# EasyEDA Pro project 硬件电路设计.epro

# Schematic Schematic1
Create Date: 2024-06-06; Page Name: P1; Project Name: 四轴飞行器; Schematic Name: Schematic1; Update Date: 2024-06-08; Company: 嘉立创EDA; Page Size: A4; Version: V1.0
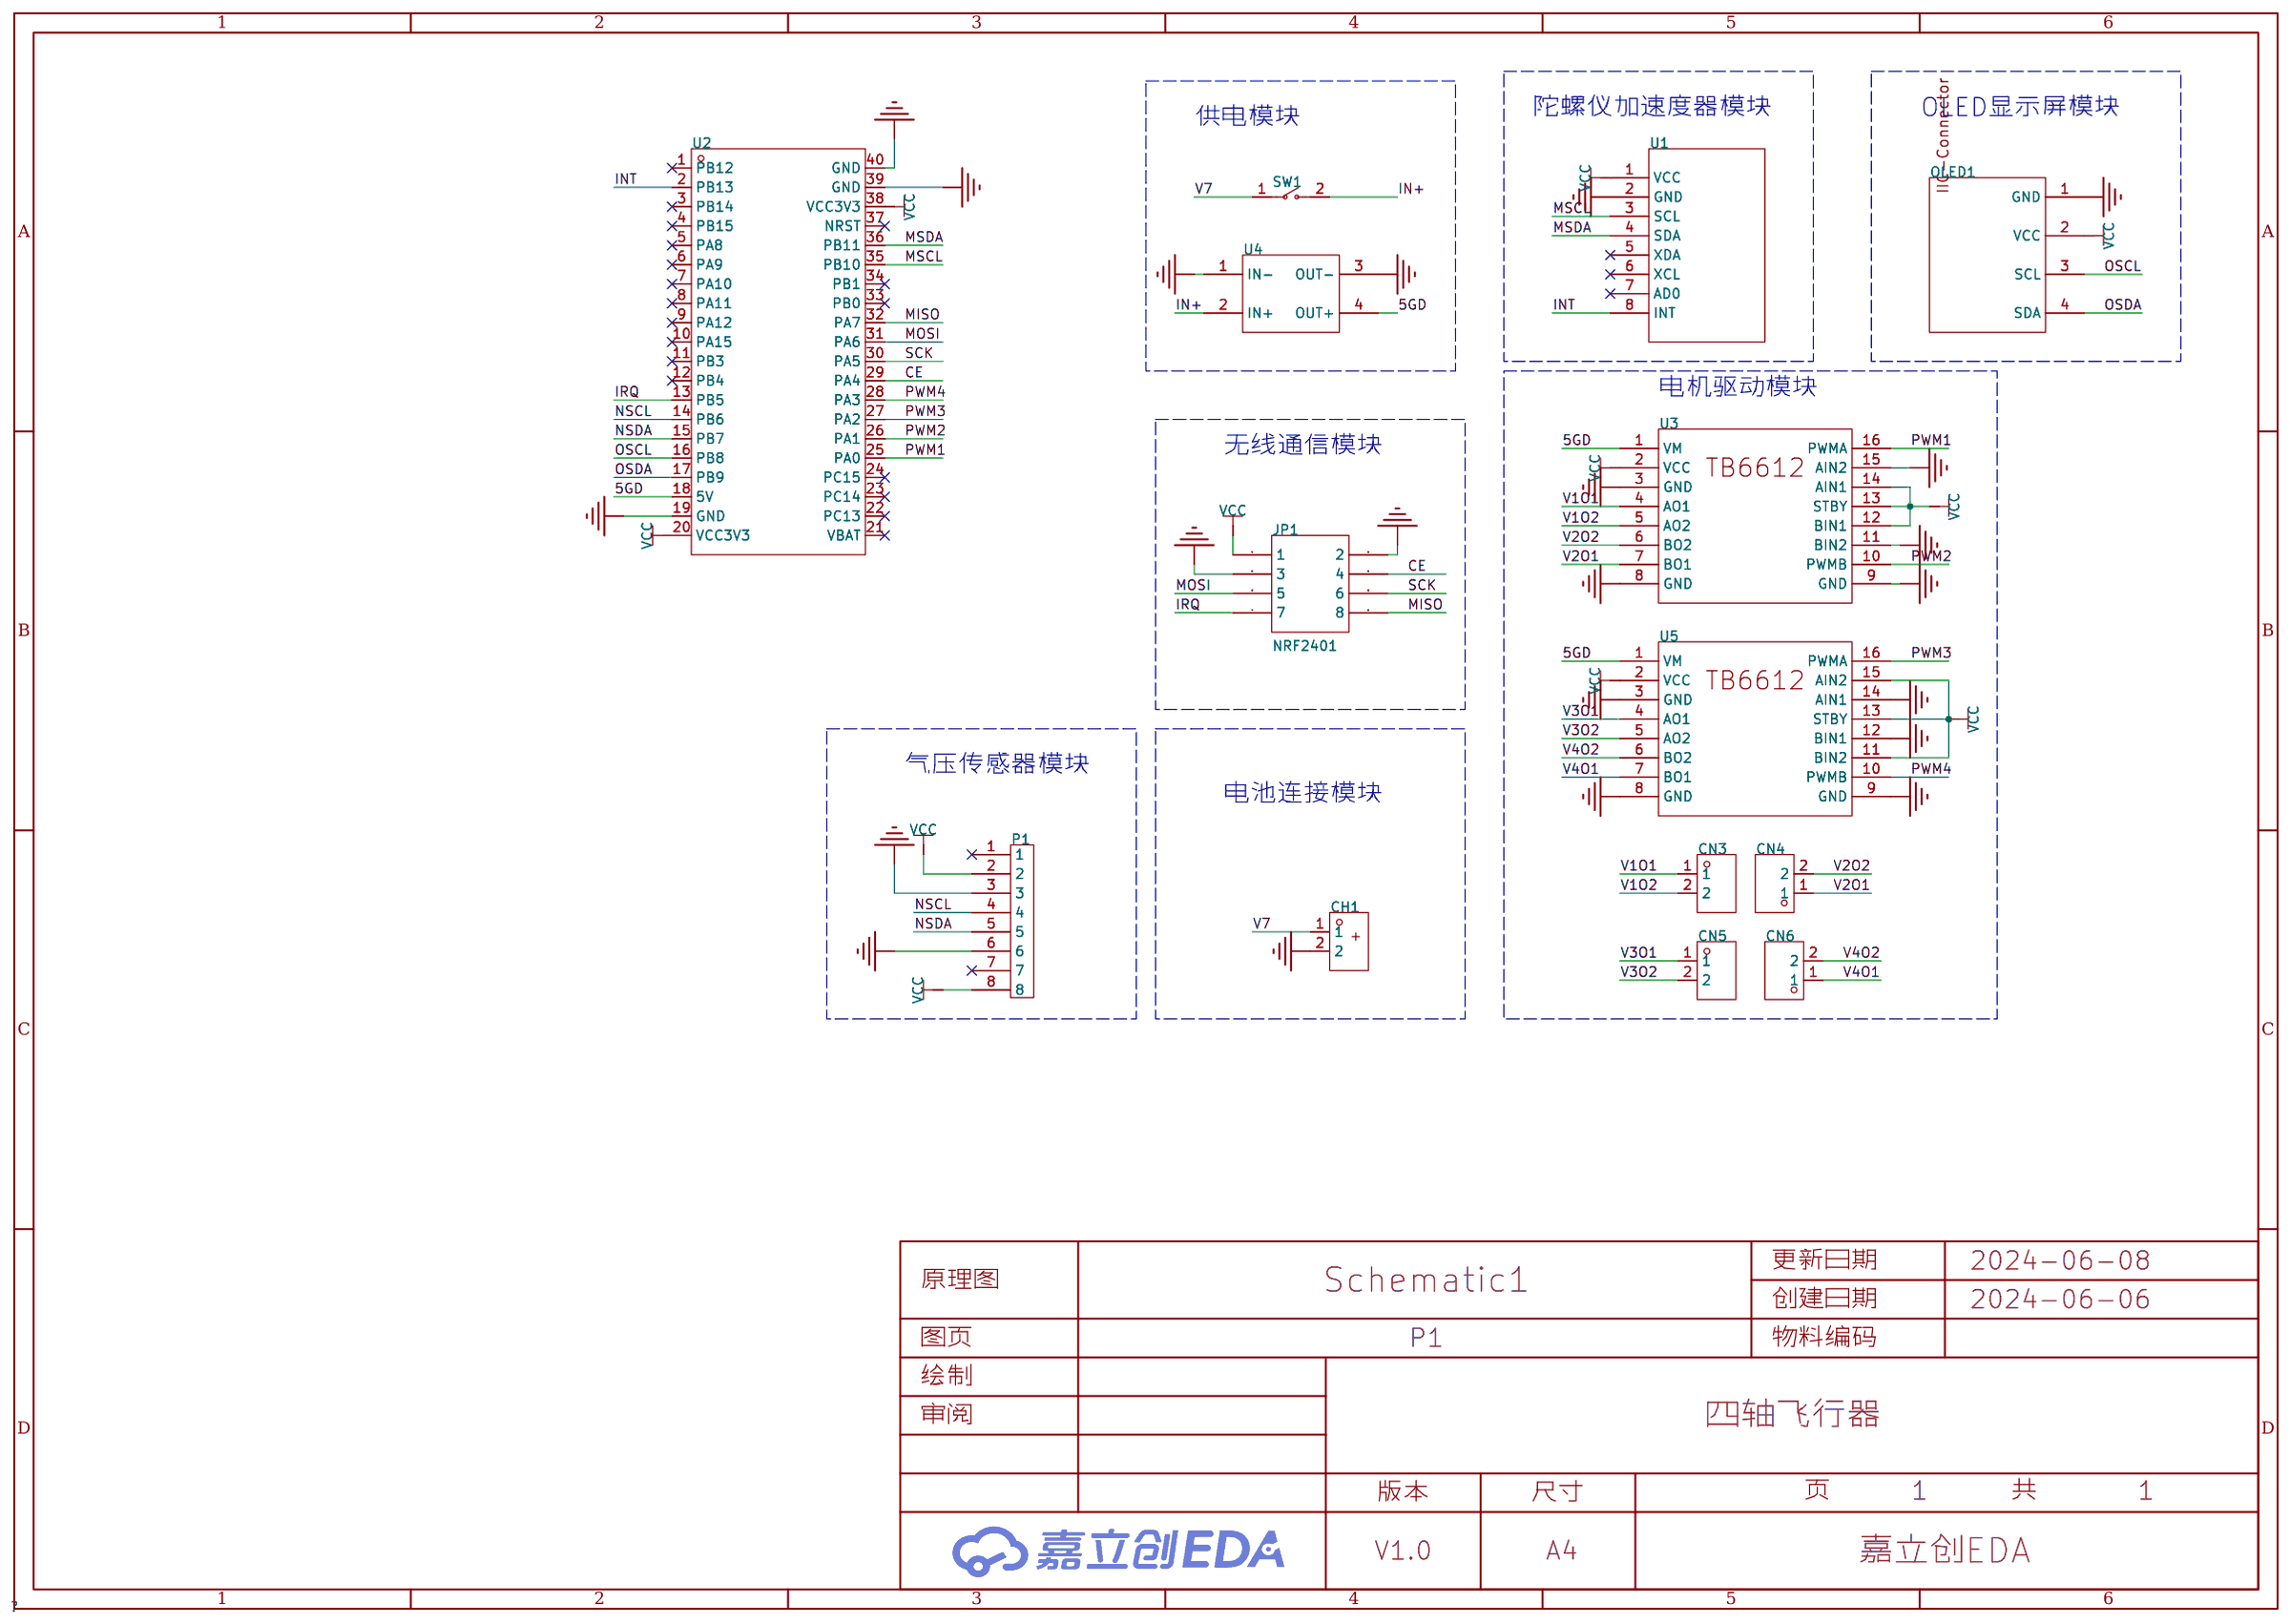
[diagram p0: schematic sheet]

## Parts
CH1  -  [航模电池线通孔]
CN3  ZX-XH2.54-2PZZ  [CONN-TH_2P-P2.50_HX25003-2A]
CN4  ZX-XH2.54-2PZZ  [CONN-TH_2P-P2.50_HX25003-2A]
CN5  ZX-XH2.54-2PZZ  [CONN-TH_2P-P2.50_HX25003-2A]
CN6  ZX-XH2.54-2PZZ  [CONN-TH_2P-P2.50_HX25003-2A]
JP1  NRF2401  [IDE2X4]
OLED1  0.96OLED_4P_MODULE_JX  [0.96OLED_4P]
P1  -  [排针1*8]
SW1  KCD11-2P-R  [SW-TH_2P-L15.0-W10.5-P5.00_KCD11-2P-R]
U1  -  [Module-MPU6050]
U2  STM32F103C8T6-Card  [CONN-TH_L53.3-W22.9_STM32F103C8T6-CARD]
U3  -  [TB6612电机驱动模块]
U4  -  [MP1548EN可调电源模块]
U5  -  [TB6612电机驱动模块]

## Library data of the parts
CH1 = 航模电池接线通孔
CN3-CN6 = ZX-XH2.54-2PZZ: 插针结构:1x2P;间距:2.54mm;安装方式:直插;参考系列:XH;总PIN数:2P;排数:1;每排PIN数:2;行距:-;额定电流:3A;触头材质:黄铜;触头镀层:锡;工作温度范围:-25℃~+85℃;; Supplier Part: C7429632; Manufacturer: Megastar(兆星); Supplier Footprint: 插件,P=2.54mm; JLCPCB Part Class: 扩展库; Datasheet: https://atta.szlcsc.com/upload/public/pdf/source/20230619/19BA6947230AA44A04D3EDD65E618FD0.pdf; Supplier: LCSC; Pins Structure: 1x2P; Pitch: 2.54mm; Mounting Style: 直插; Reference Series: XH; Number of Pins: 2P; Number of Rows: 1; Number of PINs Per Row: 2; Current Rating (Max): 3A; Contact Material: 黄铜; Contact Plating: 锡; Operating Temperature Range: -25℃~+85℃
JP1 = NRF2401
OLED1 = 0.96OLED_4P_MODULE_JX: Supplier Part: C9900004566; Supplier Footprint: 插件; JLCPCB Part Class: 扩展库; Supplier: LCSC
P1 = 排针1*8
SW1 = KCD11-2P-R: 带灯:无;引脚样式:焊片;额定电流:3A;额定电压(AC):250V;额定电压(DC):-;电路结构:单刀单掷;机械寿命:1万次;; LCSC Part Name: 10.5*15mm 两脚两档跷板开关 红钮; Supplier Part: C5884414; Manufacturer: SHOU HAN(首韩); Supplier Footprint: 插件; JLCPCB Part Class: 扩展库; Datasheet: https://atta.szlcsc.com/upload/public/pdf/source/20230506/CD06DFDE35C8048D34175BFF4AF6A2C2.pdf; Supplier: LCSC; Switch Length: 15mm; Switch Width: 10.5mm; Switch Height: 17.2mm; Actuator Type: 凹面弯曲; With Lamp: 无; Pin Style: 焊片; Actuator Color: 红色; Contact Current: 3A; Voltage Rating (AC): 250V; Circuit: 单刀单掷; Mechanical Life: 1万次; Operating Temperature: 0℃~+125℃; Actuator Identifier: - O
U1 = MPU6050模块
U2 = STM32F103C8T6-Card: Supplier Part: C9900077949; Supplier Footprint: 插件; Supplier: LCSC
U3 U5 = TB6612电机驱动模块
U4 = MP1584EN可调电源降压模块: 输入4.5-28V；输出0.8-20V，Max3A；尺寸22*17*4mm; Manufacturer: 淘宝zave旗舰店

## Nets
GND: CH1.2 JP1.2 JP1.3 OLED1.1(GND) P1.3 P1.6 U1.2(GND) U2.19(GND) U2.39(GND) U2.40(GND) U3.3(GND) U3.8(GND) U3.9(GND) U3.11(BIN2) U3.15(AIN2) U4.1(IN-) U4.3(OUT-) U5.3(GND) U5.8(GND) U5.9(GND) U5.12(BIN1) U5.14(AIN1)
V1O1: CN3.1 U3.4(AO1)
V1O2: CN3.2 U3.5(AO2)
V2O1: CN4.1 U3.7(BO1)
V2O2: CN4.2 U3.6(BO2)
V3O1: CN5.1 U5.4(AO1)
V3O2: CN5.2 U5.5(AO2)
V4O1: CN6.1 U5.7(BO1)
V4O2: CN6.2 U5.6(BO2)
V7: CH1.1 SW1.1
VCC: JP1.1 OLED1.2(VCC) P1.2 P1.8 U1.1(VCC) U2.20(VCC3V3) U2.38(VCC3V3) U3.2(VCC) U3.12(BIN1) U3.13(STBY) U3.14(AIN1) U5.2(VCC) U5.11(BIN2) U5.13(STBY) U5.15(AIN2)
5GD: U2.18(5V) U3.1(VM) U4.4(OUT+) U5.1(VM)
CE: JP1.4 U2.29(PA4)
IN+: SW1.2 U4.2(IN+)
INT: U1.8(INT) U2.2(PB13)
IRQ: JP1.7 U2.13(PB5)
MISO: JP1.8 U2.32(PA7)
MOSI: JP1.5 U2.31(PA6)
MSCL: U1.3(SCL) U2.35(PB10)
MSDA: U1.4(SDA) U2.36(PB11)
NSCL: P1.4 U2.14(PB6)
NSDA: P1.5 U2.15(PB7)
OSCL: OLED1.3(SCL) U2.16(PB8)
OSDA: OLED1.4(SDA) U2.17(PB9)
PWM1: U2.25(PA0) U3.16(PWMA)
PWM2: U2.26(PA1) U3.10(PWMB)
PWM3: U2.27(PA2) U5.16(PWMA)
PWM4: U2.28(PA3) U5.10(PWMB)
SCK: JP1.6 U2.30(PA5)

Not connected (* = marked no-connect by the designer): P1 1* 7*; U1 5(XDA)* 6(XCL)* 7(AD0)*; U2 1(PB12)* 3(PB14)* 4(PB15)* 5(PA8)* 6(PA9)* 7(PA10)* 8(PA11)* 9(PA12)* 10(PA15)* 11(PB3)* 12(PB4)* 21(VBAT)* 22(PC13)* 23(PC14)* 24(PC15)* 33(PB0)* 34(PB1)* 37(NRST)*

## Notes on the sheet
- 供电模块
- 陀螺仪加速度器模块
- OLED显示屏模块
- 电机驱动模块
- 无线通信模块
- 气压传感器模块
- 电池连接模块

# Schematic Schematic2
Create Date: 2024-06-08; Page Name: P1; Project Name: 四轴飞行器; Schematic Name: Schematic2; Update Date: 2024-06-08; Company: 嘉立创EDA; Page Size: A4; Version: V1.0
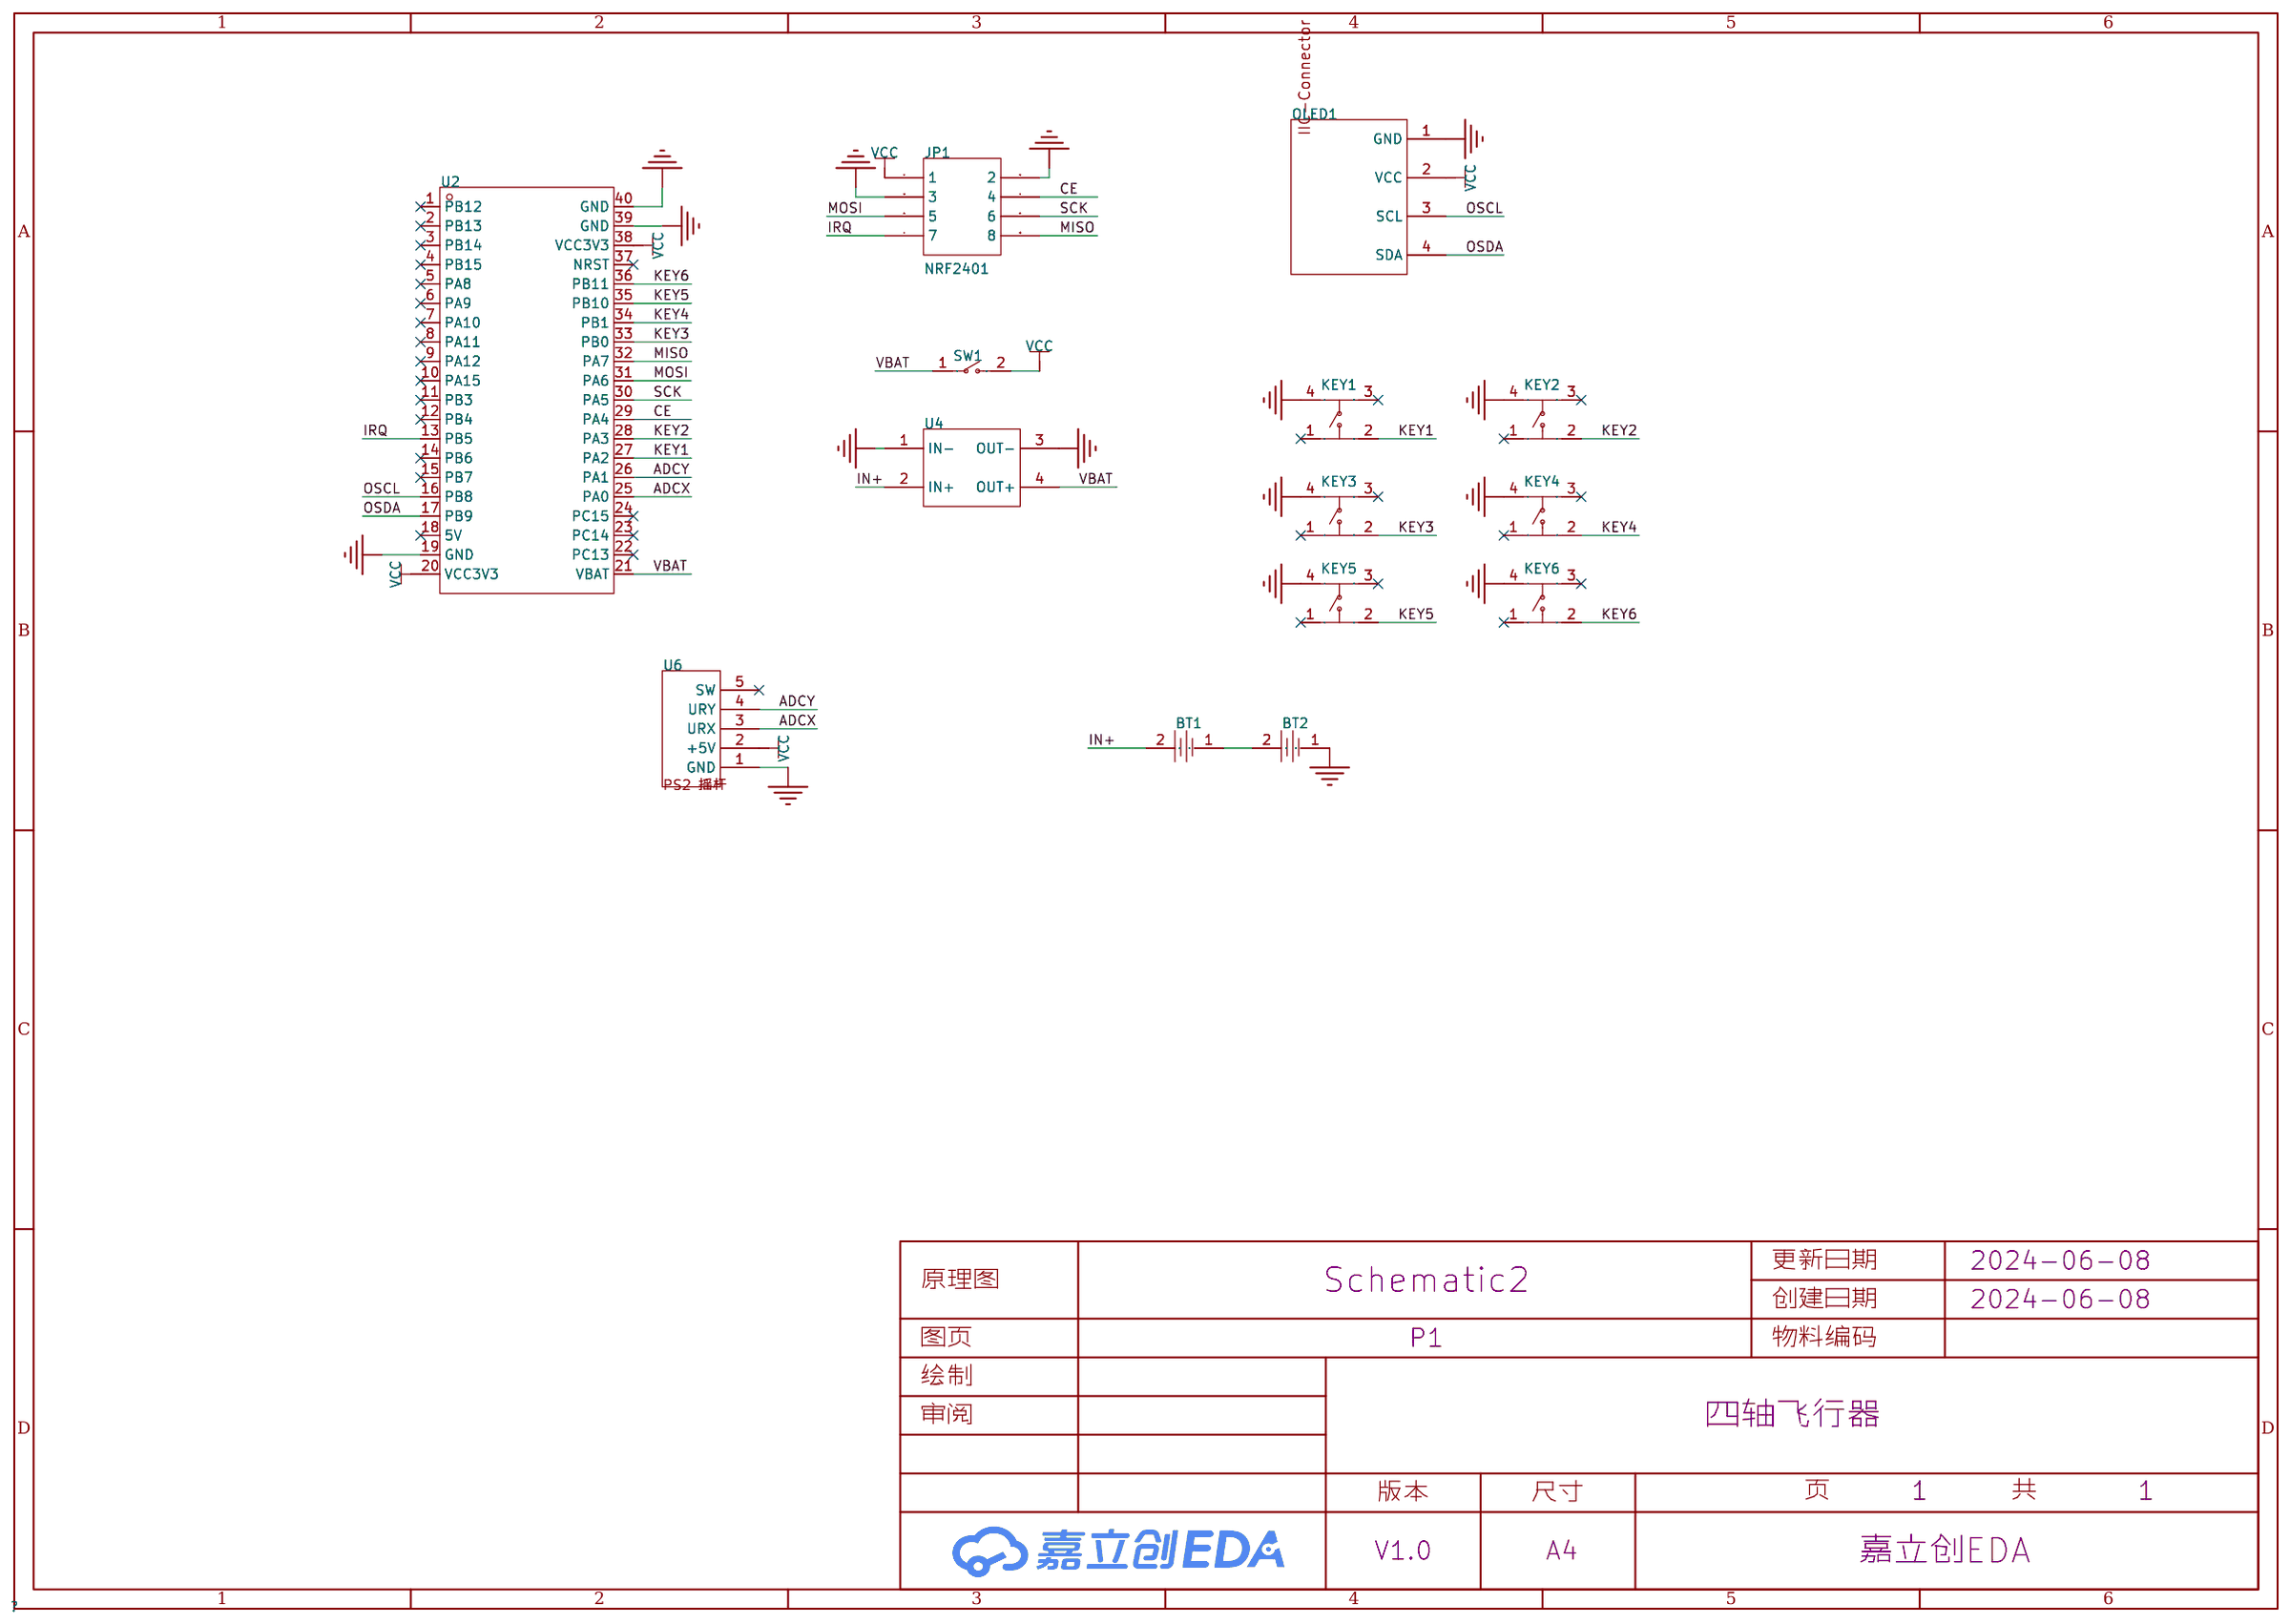
[diagram p1: schematic sheet]

## Parts
BT1  BH-18650-A1AJ005  [BAT-TH_BH-18650-A1AJ005]
BT2  BH-18650-A1AJ005  [BAT-TH_BH-18650-A1AJ005]
JP1  NRF2401  [IDE2X4]
KEY1  B3F-4055  [KEY-TH_4P-L12.0-W12.0-P5.00-LS13.4-EH]
KEY2  B3F-4055  [KEY-TH_4P-L12.0-W12.0-P5.00-LS13.4-EH]
KEY3  B3F-4055  [KEY-TH_4P-L12.0-W12.0-P5.00-LS13.4-EH]
KEY4  B3F-4055  [KEY-TH_4P-L12.0-W12.0-P5.00-LS13.4-EH]
KEY5  B3F-4055  [KEY-TH_4P-L12.0-W12.0-P5.00-LS13.4-EH]
KEY6  B3F-4055  [KEY-TH_4P-L12.0-W12.0-P5.00-LS13.4-EH]
OLED1  0.96OLED_4P_MODULE_JX  [0.96OLED_4P]
SW1  KCD11-2P-R  [SW-TH_2P-L15.0-W10.5-P5.00_KCD11-2P-R]
U2  STM32F103C8T6-Card  [CONN-TH_L53.3-W22.9_STM32F103C8T6-CARD]
U4  -  [MP1548EN可调电源模块]
U6  -  [PS2摇杆模块]

## Library data of the parts
BT1 BT2 = BH-18650-A1AJ005: 连接器类型:电池盒;适用电池规格:18650;; LCSC Part Name: 电池盒 适用电池:18650; Supplier Part: C5290176; Manufacturer: MYOUNG(美阳); Datasheet: https://atta.szlcsc.com/upload/public/pdf/source/20221129/D0CEC1B107B5F52E469FD9B49033E00F.pdf; Supplier: LCSC; Connector Type: 电池盒; Battery Type: 18650
JP1 = NRF2401
KEY1-KEY6 = B3F-4055_C84931: 电路结构:单刀单掷;按钮形状:矩形按钮;安装方式:直插;开关长度:12mm;开关宽度:12mm;开关高度:7.3mm;触点电流:50mA;额定电压(DC):24V;带灯:-;机械寿命:-;; LCSC Part Name: 12*12*7.3mm 直插 轻触开关; Supplier Part: C84931; Manufacturer: OMRON(欧姆龙); Supplier Footprint: 插件; JLCPCB Part Class: 扩展库; Datasheet: https://atta.szlcsc.com/upload/public/pdf/source/20170810/C93157_1502335414592880008.pdf; Supplier: LCSC; Circuit: 单刀单掷; Actuator Style: 矩形按钮; Mounting Style: 直插; Switch Length: 12mm; Switch Width: 12mm; Switch Height: 7.3mm; Contact Current: 50mA; Voltage Rating (DC): 24V
OLED1 = 0.96OLED_4P_MODULE_JX: Supplier Part: C9900004566; Supplier Footprint: 插件; JLCPCB Part Class: 扩展库; Supplier: LCSC
SW1 = KCD11-2P-R: 带灯:无;引脚样式:焊片;额定电流:3A;额定电压(AC):250V;额定电压(DC):-;电路结构:单刀单掷;机械寿命:1万次;; LCSC Part Name: 10.5*15mm 两脚两档跷板开关 红钮; Supplier Part: C5884414; Manufacturer: SHOU HAN(首韩); Supplier Footprint: 插件; JLCPCB Part Class: 扩展库; Datasheet: https://atta.szlcsc.com/upload/public/pdf/source/20230506/CD06DFDE35C8048D34175BFF4AF6A2C2.pdf; Supplier: LCSC; Switch Length: 15mm; Switch Width: 10.5mm; Switch Height: 17.2mm; Actuator Type: 凹面弯曲; With Lamp: 无; Pin Style: 焊片; Actuator Color: 红色; Contact Current: 3A; Voltage Rating (AC): 250V; Circuit: 单刀单掷; Mechanical Life: 1万次; Operating Temperature: 0℃~+125℃; Actuator Identifier: - O
U2 = STM32F103C8T6-Card: Supplier Part: C9900077949; Supplier Footprint: 插件; Supplier: LCSC
U4 = MP1584EN可调电源降压模块: 输入4.5-28V；输出0.8-20V，Max3A；尺寸22*17*4mm; Manufacturer: 淘宝zave旗舰店
U6 = PS2摇杆模块: _: 3

## Nets
GND: BT2.1 JP1.2 JP1.3 KEY1.4 KEY2.4 KEY3.4 KEY4.4 KEY5.4 KEY6.4 OLED1.1(GND) U2.19(GND) U2.39(GND) U2.40(GND) U4.1(IN-) U4.3(OUT-) U6.1(GND)
VBAT: SW1.1 U2.21(VBAT) U4.4(OUT+)
VCC: JP1.1 OLED1.2(VCC) SW1.2 U2.20(VCC3V3) U2.38(VCC3V3) U6.2(+5V)
ADCX: U2.25(PA0) U6.3(URX)
ADCY: U2.26(PA1) U6.4(URY)
CE: JP1.4 U2.29(PA4)
IN+: BT1.2 U4.2(IN+)
IRQ: JP1.7 U2.13(PB5)
KEY1: KEY1.2 U2.27(PA2)
KEY2: KEY2.2 U2.28(PA3)
KEY3: KEY3.2 U2.33(PB0)
KEY4: KEY4.2 U2.34(PB1)
KEY5: KEY5.2 U2.35(PB10)
KEY6: KEY6.2 U2.36(PB11)
MISO: JP1.8 U2.32(PA7)
MOSI: JP1.5 U2.31(PA6)
OSCL: OLED1.3(SCL) U2.16(PB8)
OSDA: OLED1.4(SDA) U2.17(PB9)
SCK: JP1.6 U2.30(PA5)
$1N1857: BT1.1 BT2.2

Not connected (* = marked no-connect by the designer): KEY1 1* 3*; KEY2 1* 3*; KEY3 1* 3*; KEY4 1* 3*; KEY5 1* 3*; KEY6 1* 3*; U2 1(PB12)* 2(PB13)* 3(PB14)* 4(PB15)* 5(PA8)* 6(PA9)* 7(PA10)* 8(PA11)* 9(PA12)* 10(PA15)* 11(PB3)* 12(PB4)* 14(PB6)* 15(PB7)* 18(5V)* 22(PC13)* 23(PC14)* 24(PC15)* 37(NRST)*; U6 5(SW)*

# Board PCB2
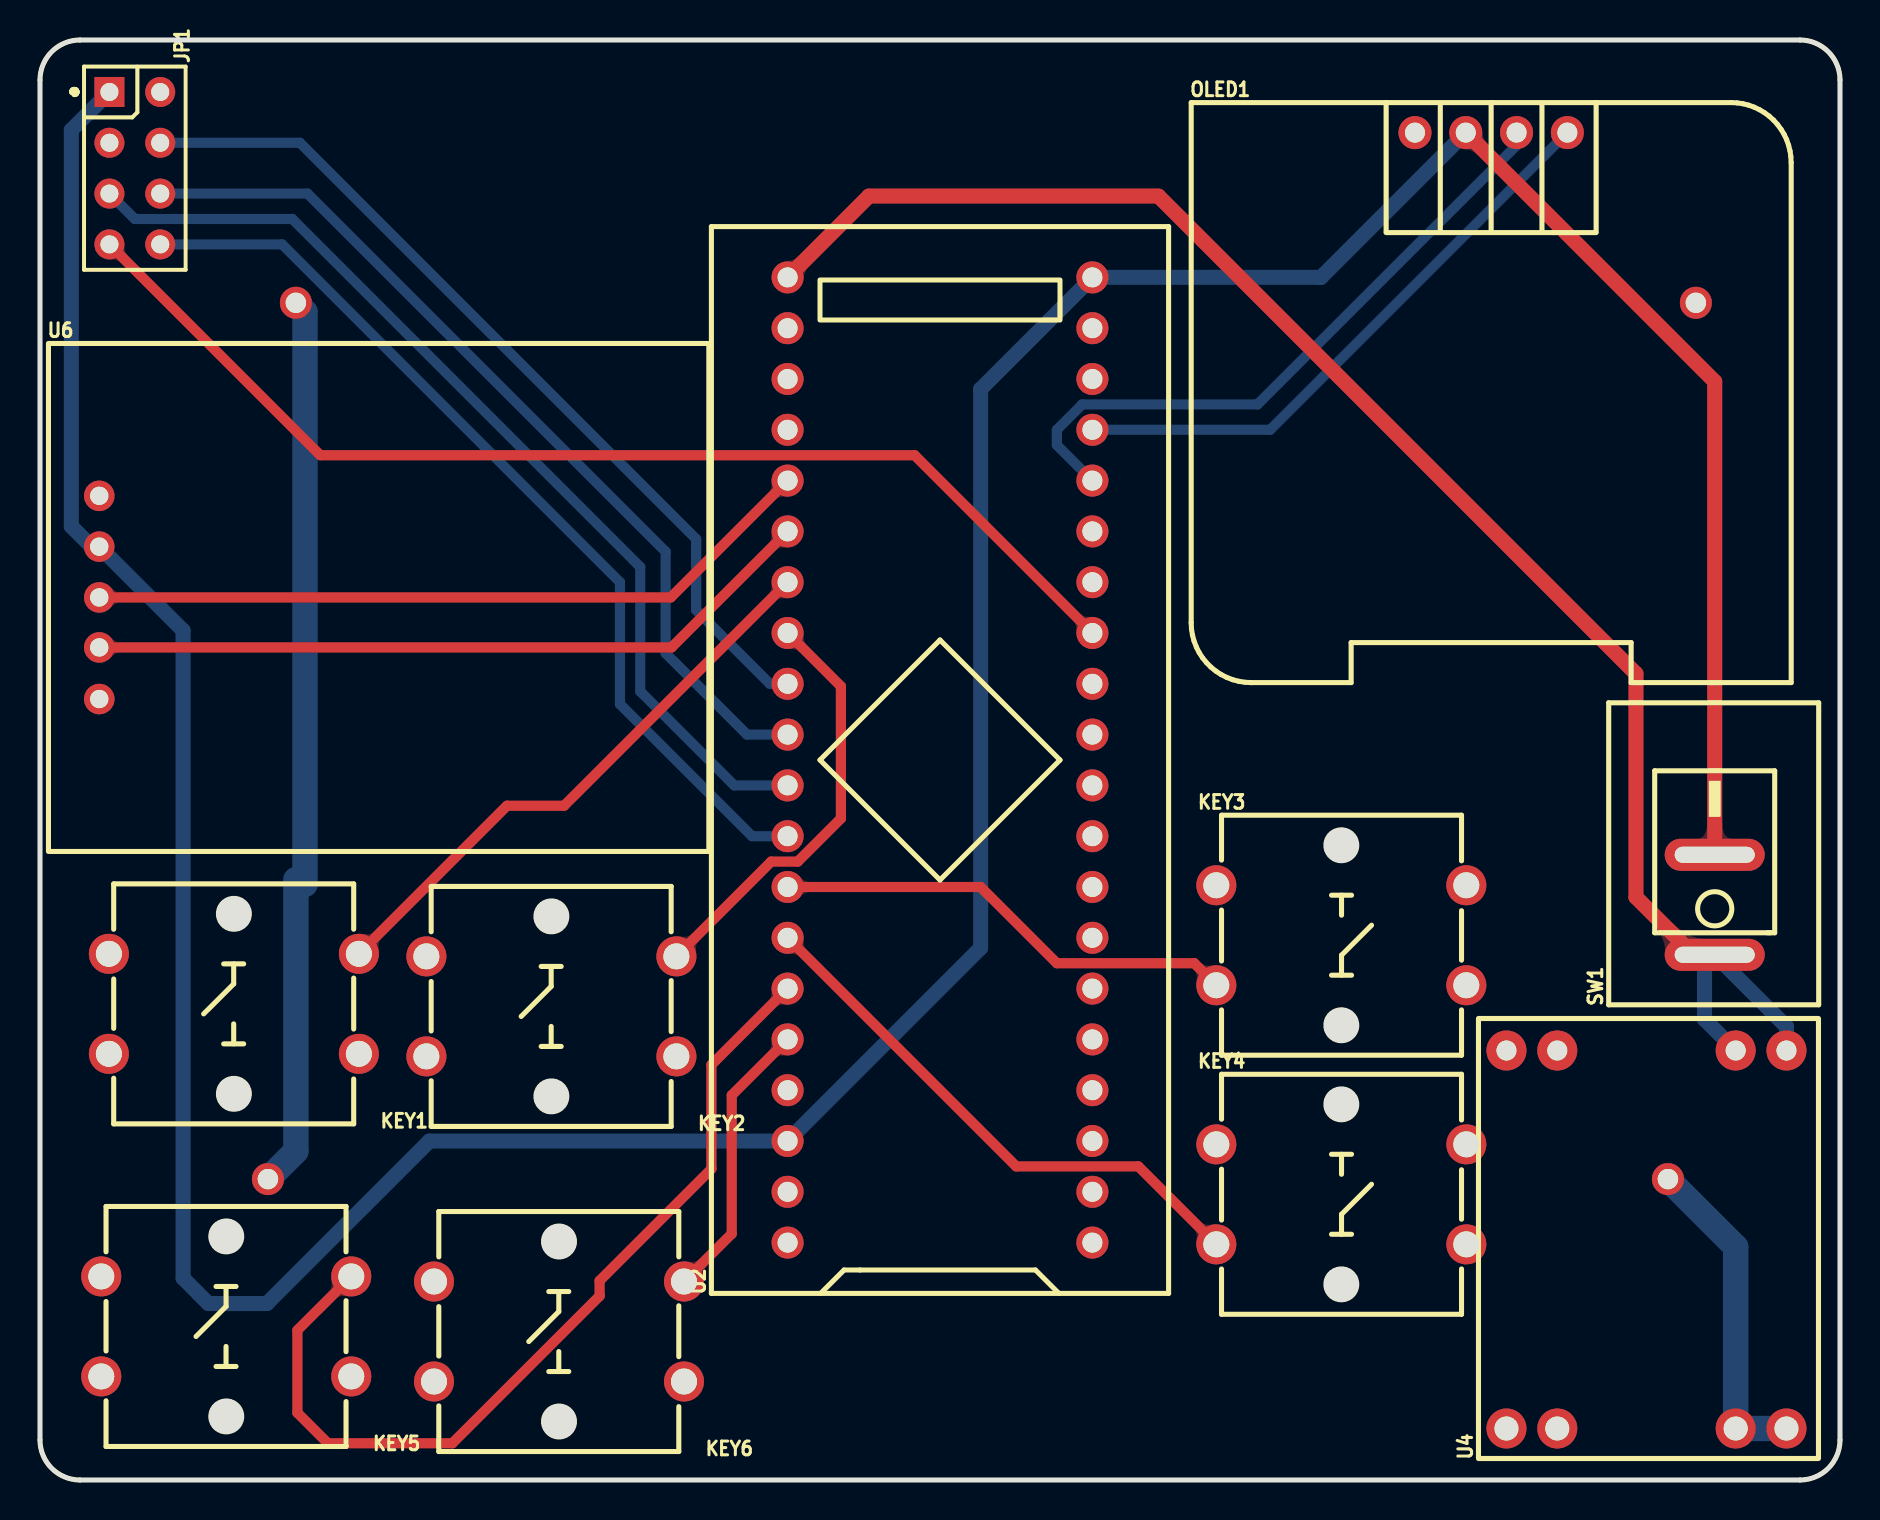
[diagram p2: board, top side]
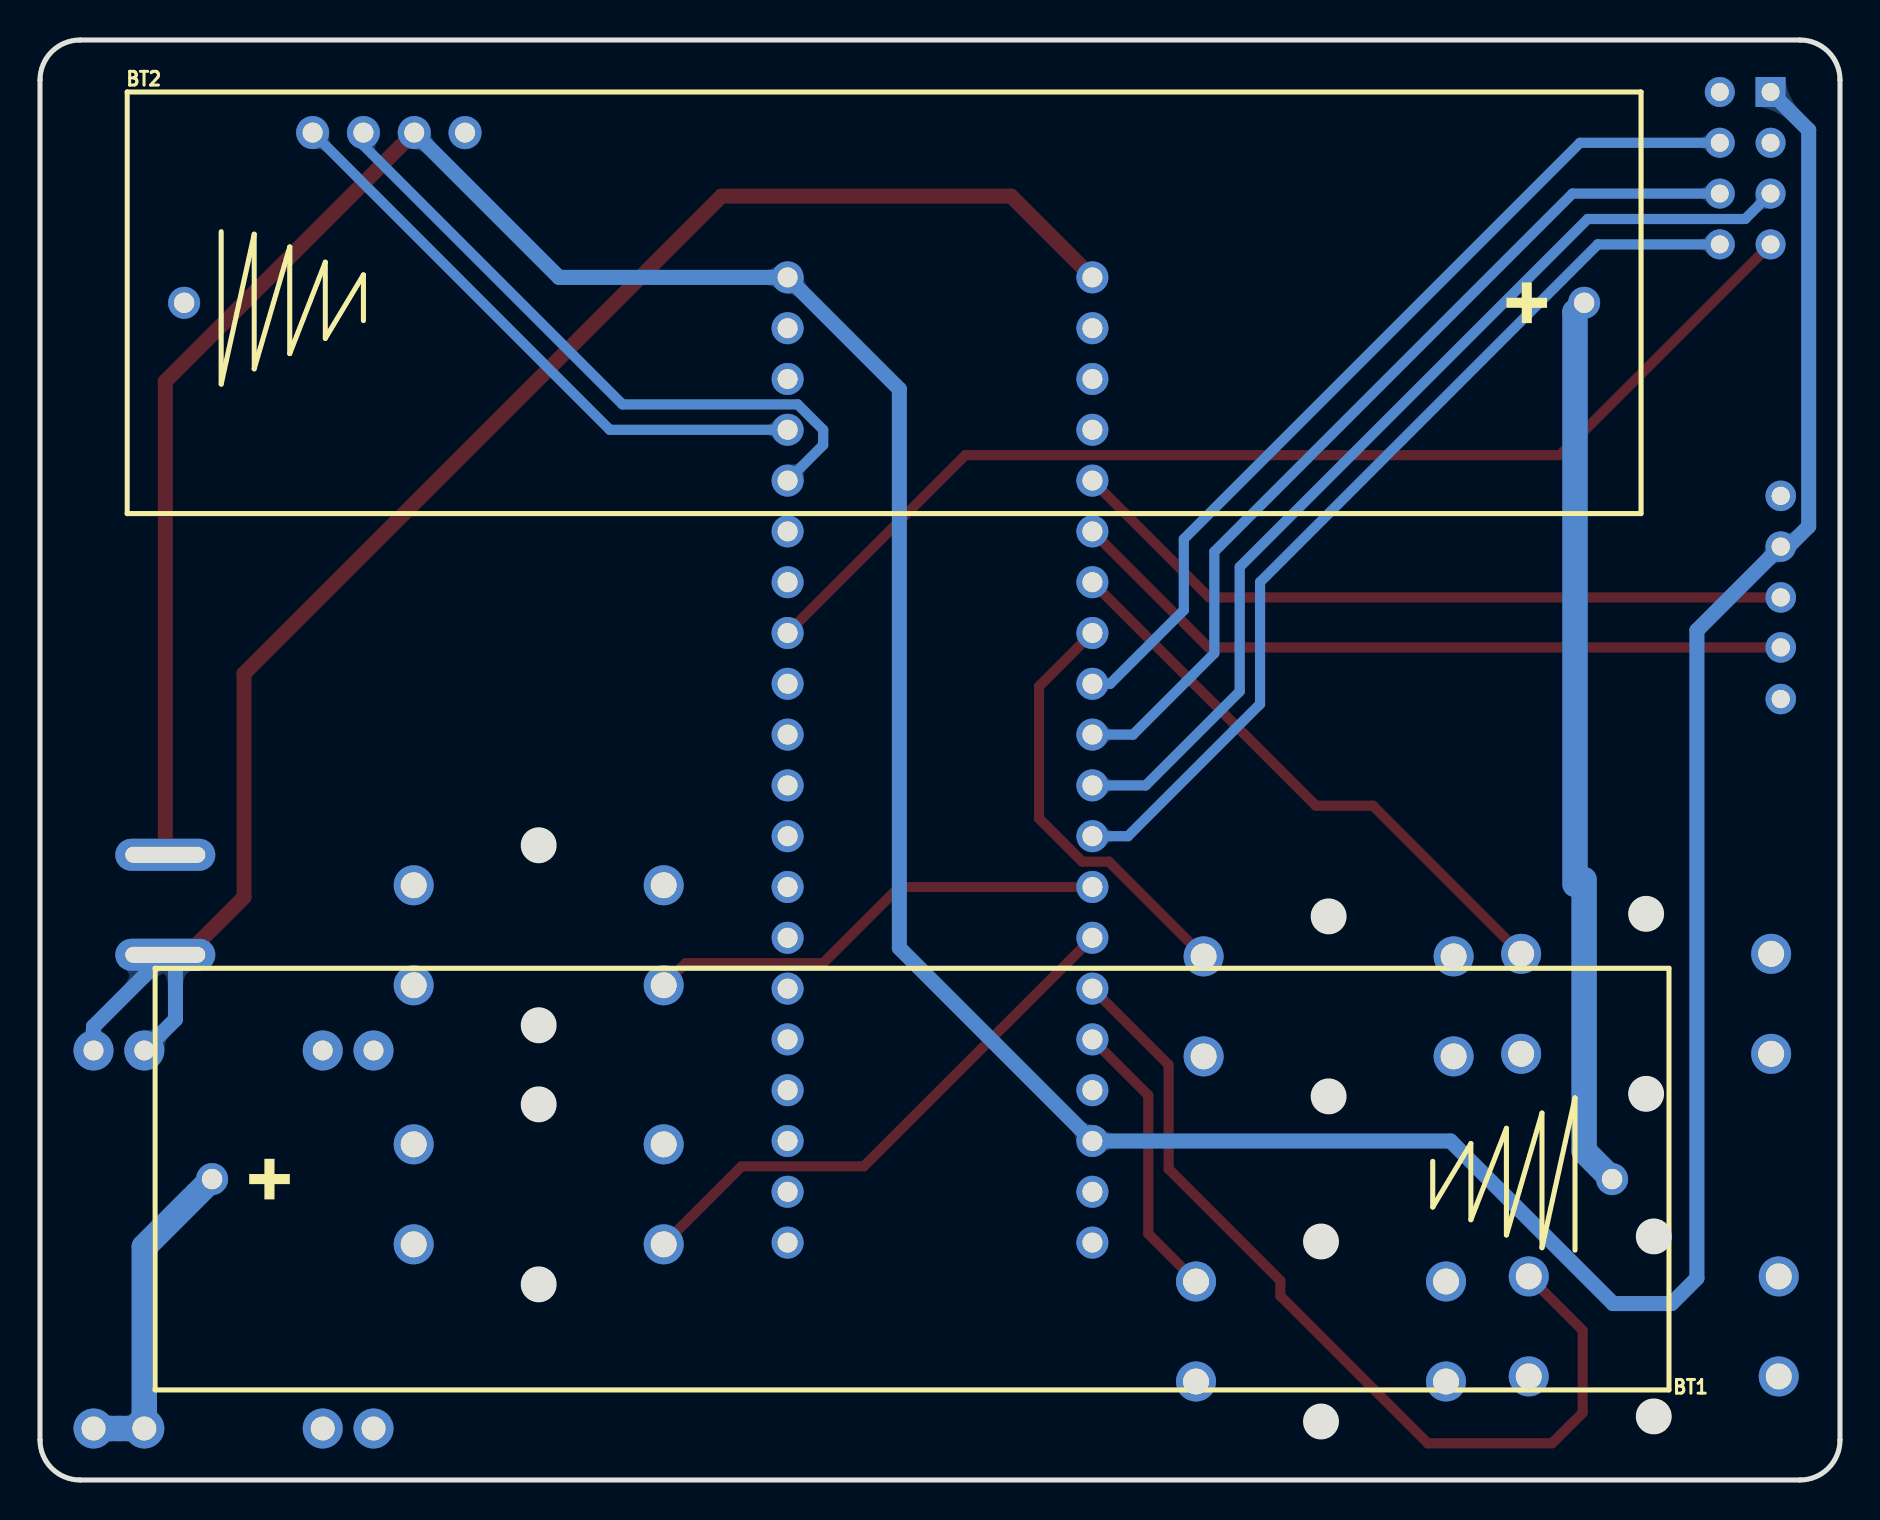
[diagram p3: board, bottom side, seen from below]

Outline 90 x 72 mm; copper layers: Top Layer, Bottom Layer. Coordinates in mm from the lower left corner of the outline.
Outline path: 0,70 0,2 arc(0.59,0.59) 2,0 88,0 arc(89.41,0.59) 90,2 90,70 arc(89.41,71.41) 88,72 2,72 arc(0.59,71.41) 0,70
Stack: Top Layer 0.035mm / Dielectric1 1.51mm FR4 er 4.5 / Bottom Layer 0.035mm

## Design rules (mm)
template: JLCPCB Capability(Two Layers Board)
spacing copperThickness1oz (default): track to track 0.102, other pairs 0.152 to 0.3
spacing copperThickness2oz: track to track 0.203, other pairs 0.152 to 0.3
track width copperThickness1oz (default): min 0.127, default 0.254, max 2.54
track width copperThickness2oz: min 0.203, default 0.254, max 2.54
differential pair differentialPair (default): width min 0.127, default 0.254, max 2.54; gap min 0.152, default 0.152
via viaSize (default): diameter min 0.5, default 0.61, max 10; hole min 0.3, default 0.305, max 6.3

## Placement (name value [footprint] x y rotation side)
BT1  BH-18650-A1AJ005  [BAT-TH_BH-18650-A1AJ005]  46.4 15.04 0 bottom
BT2  BH-18650-A1AJ005  [BAT-TH_BH-18650-A1AJ005]  47.79 58.86 180 bottom
JP1  NRF2401  [IDE2X4]  3.47 69.4 270 top
KEY1  B3F-4055  [KEY-TH_4P-L12.0-W12.0-P5.00-LS13.4-EH]  9.69 23.81 180 top
KEY2  B3F-4055  [KEY-TH_4P-L12.0-W12.0-P5.00-LS13.4-EH]  25.57 23.68 180 top
KEY3  B3F-4055  [KEY-TH_4P-L12.0-W12.0-P5.00-LS13.4-EH]  65.07 27.24 0 top
KEY4  B3F-4055  [KEY-TH_4P-L12.0-W12.0-P5.00-LS13.4-EH]  65.07 14.28 0 top
KEY5  B3F-4055  [KEY-TH_4P-L12.0-W12.0-P5.00-LS13.4-EH]  9.31 7.68 180 top
KEY6  B3F-4055  [KEY-TH_4P-L12.0-W12.0-P5.00-LS13.4-EH]  25.95 7.43 180 top
OLED1  0.96OLED_4P_MODULE_JX  [0.96OLED_4P]  72.56 67.37 0 top
SW1  KCD11-2P-R  [SW-TH_2P-L15.0-W10.5-P5.00_KCD11-2P-R]  83.74 28.76 90 top
U2  STM32F103C8T6-Card  [CONN-TH_L53.3-W22.9_STM32F103C8T6-CARD]  45 36 90 top
U4  -  [MP1548EN可调电源模块]  71.92 1.07 90 top
U6  -  [PS2摇杆模块]  0.42 36.51 0 top

## Footprints (pads in the part's own frame, mm; a bottom-side part is the same pattern mirrored in y, then rotated)
0.96OLED_4P
  round 1.65 hole 1: 1(-3.81,-0.002) 2(-1.27,0.002) 3(1.27,0.002) 4(3.81,0.002)
BAT-TH_BH-18650-A1AJ005
  round 1.6 hole 1.02: 1(-35,0) 2(35,0)
CONN-TH_L53.3-W22.9_STM32F103C8T6-CARD
  round 1.6 hole 1: 1(-24.13,-7.62) 2(-21.59,-7.62) 3(-19.05,-7.62) 4(-16.51,-7.62) 5(-13.97,-7.62) 6(-11.43,-7.62) 7(-8.89,-7.62) 8(-6.35,-7.62) 9(-3.81,-7.62) 10(-1.27,-7.62) 11(1.27,-7.62) 12(3.81,-7.62) 13(6.35,-7.62) 14(8.89,-7.62) 15(11.43,-7.62) 16(13.97,-7.62) 17(16.51,-7.62) 18(19.05,-7.62) 19(21.59,-7.62) 20(24.13,-7.62) 21(24.13,7.62) 22(21.59,7.62) 23(19.05,7.62) 24(16.51,7.62) 25(13.97,7.62) 26(11.43,7.62) 27(8.89,7.62) 28(6.35,7.62) 29(3.81,7.62) 30(1.27,7.62) 31(-1.27,7.62) 32(-3.81,7.62) 33(-6.35,7.62) 34(-8.89,7.62) 35(-11.43,7.62) 36(-13.97,7.62) 37(-16.51,7.62) 38(-19.05,7.62) 39(-21.59,7.62) 40(-24.13,7.62)
IDE2X4
  rect 1.5x1.5 hole 0.9: 1(0,0)
  round 1.5 hole 0.9: 2(0,2.54) 3(2.54,0) 4(2.54,2.54) 5(5.08,0) 6(5.08,2.54) 7(7.62,0) 8(7.62,2.54)
KEY-TH_4P-L12.0-W12.0-P5.00-LS13.4-EH
  round 2 hole 1.3: 1(6.25,-2.5) 2(-6.25,-2.5) 3(6.25,2.5) 4(-6.25,2.5)
MP1548EN可调电源模块
  round 2 hole 1.2: 1(1.5,-1.4) 1(1.5,-3.94) 2(1.5,-12.86) 2(1.5,-15.4)
  round 2 hole 1: 3(20.4,-1.4) 3(20.4,-3.94) 4(20.4,-12.86) 4(20.4,-15.4)
PS2摇杆模块
  round 1.524 hole 0.914: 1(2.54,12.7) 2(2.54,10.16) 3(2.54,7.62) 4(2.54,5.12) 5(2.54,2.54)
SW-TH_2P-L15.0-W10.5-P5.00_KCD11-2P-R
  oval 1.6x5 hole 0.8x4: 1(-2.5,0) 2(2.5,0)

## Nets
As in the schematic.

Pads without a net: KEY1 1 3; KEY2 1 3; KEY3 1 3; KEY4 1 3; KEY5 1 3; KEY6 1 3; U2 1 2 3 4 5 6 7 8 9 10 11 12 14 15 18 22 23 24 37; U6 5

## Routing (per net, layer and track width the routed paths; a pad name or vN(x,y) marks a point on that pad's centre or on a via; arc(x,y) is an arc through that point)
VBAT: length 82.2
  Top Layer w0.75: SW1.1 82.68,26.26 79.8,29.14 79.8,40.32 55.92,64.19 41.44,64.19 U2.21
  Bottom Layer w0.75: U4.4 83.23,23.03 83.23,25.75 SW1.1 87.32,22.67 U4.4
VCC: length 209.2
  Top Layer w0.75: OLED1.2 83.74,54.92 SW1.2
  Bottom Layer w0.75: JP1.1 1.57,67.5 1.57,47.68 2.58,46.67 U6.2 7.15,42.48 7.15,10.09 8.42,8.82 11.34,8.82 19.47,16.95 U2.38 47.03,26.6 47.03,54.54 U2.20 64.05,60.13 OLED1.2
ADCX: length 36.8
  Top Layer w0.508: U2.25 31.54,44.13 U6.3
ADCY: length 36.8
  Top Layer w0.508: U2.26 31.58,41.63 U6.4
CE: length 44.7
  Bottom Layer w0.508: JP1.4 13,66.86 32.81,47.05 32.81,43.49 36.49,39.81 U2.29
IN+: length 16.4
  Bottom Layer w1.27: U4.2 U4.2 84.78,11.66 BT1.2
IRQ: length 57.2
  Top Layer w0.508: U2.13 43.73,51.24 14.01,51.24 JP1.7
KEY1: length 29.1
  Top Layer w0.508: U2.27 26.2,33.71 23.35,33.71 KEY1.2
KEY2: length 21.5
  Top Layer w0.508: U2.28 40.05,39.68 40.05,33.08 37.89,30.92 36.56,30.92 KEY2.2
KEY3: length 23.5
  Top Layer w0.508: U2.33 47.03,29.65 50.84,25.84 57.71,25.84 KEY3.2
KEY4: length 27.8
  Top Layer w0.508: U2.34 48.81,15.68 54.92,15.68 KEY4.2
KEY5: length 46
  Top Layer w0.508: KEY5.2 12.87,7.49 12.87,3.36 14.39,1.84 20.62,1.84 27.98,9.2 27.98,9.97 33.57,15.55 33.57,20.76 U2.35
KEY6: length 14.3
  Top Layer w0.508: KEY6.2 34.59,12.31 34.59,19.24 U2.36
MISO: length 47.2
  Bottom Layer w0.508: JP1.8 12.11,61.78 29,44.89 29,38.79 35.6,32.19 U2.32
MOSI: length 49.8
  Bottom Layer w0.508: U2.31 34.71,34.73 30.01,39.43 30.01,45.65 12.61,63.05 4.74,63.05 JP1.5
OSCL: length 32.8
  Bottom Layer w0.508: U2.16 50.84,51.75 50.84,52.51 52.11,53.78 60.88,53.78 73.83,66.73 OLED1.3
OSDA: length 29.9
  Bottom Layer w0.508: OLED1.4 61.51,52.51 U2.17
SCK: length 45.5
  Bottom Layer w0.508: JP1.6 13.38,64.32 31.28,46.41 31.28,41.33 35.35,37.27 U2.30
$1N1857: length 44.8
  Bottom Layer w1.27: BT1.1 12.79,16.44 12.79,30.02 ; 13.25,29.78 13.25,58.4 BT2.2

## Copper pours and planes (outline as drawn; the poured copper is in the pictures)
GND on Top Layer: -31.33,76.13 114.85,76.13 114.85,-3.5 -31.33,-3.5
GND on Bottom Layer: -3.01,93.02 92.75,93.02 92.75,-15.44 -3.01,-15.44

Small or netless copper shapes (teardrops, artwork), in the pictures only: 22 on Top Layer, 30 on Bottom Layer

# Board PCB1
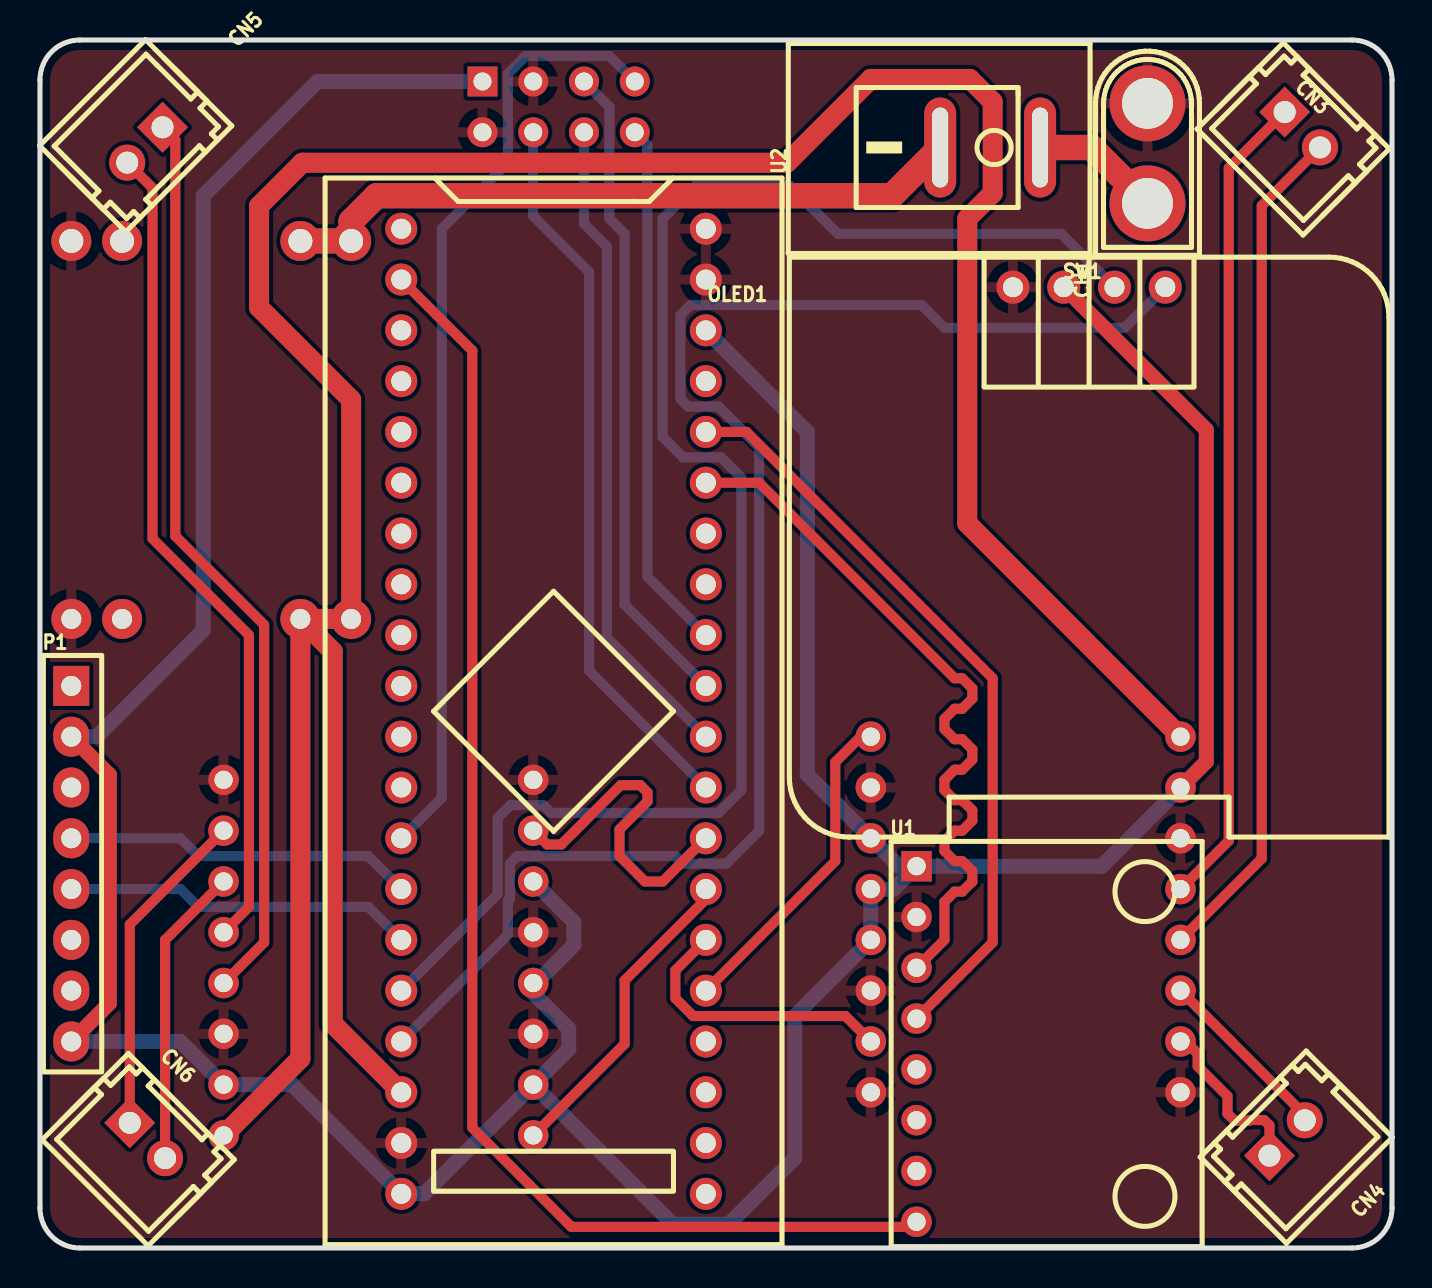
[diagram p4: board, top side]
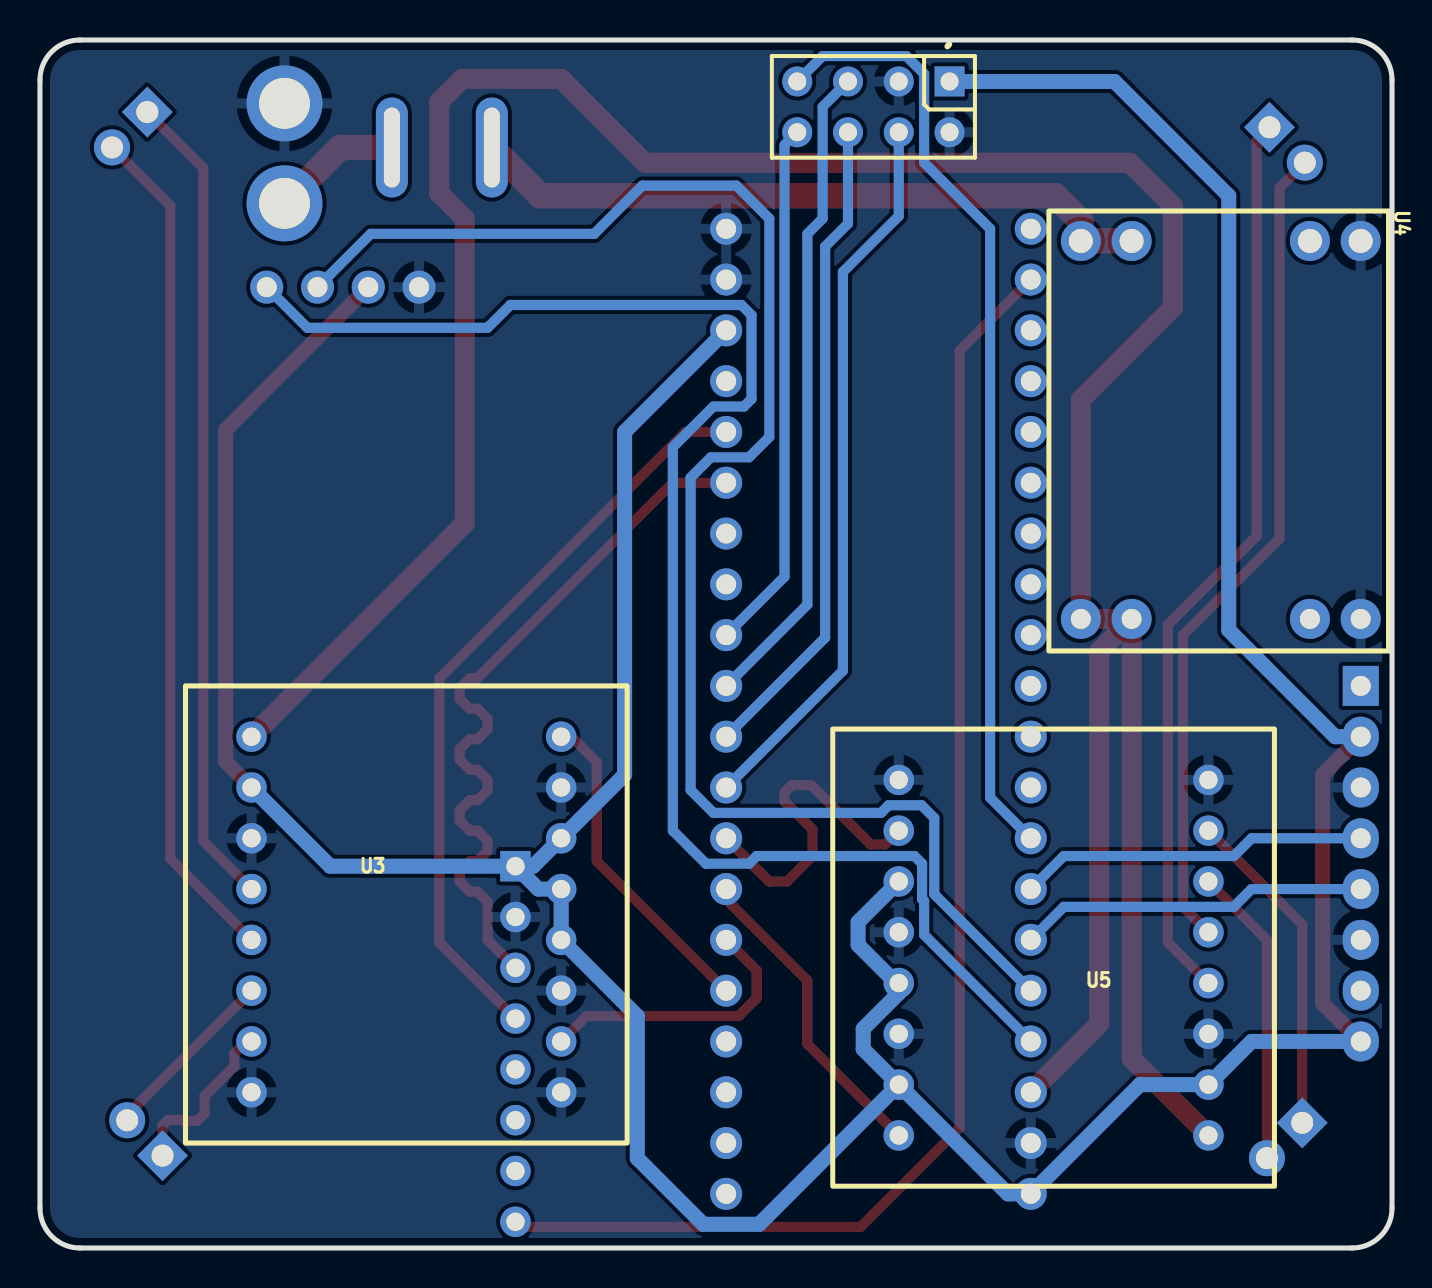
[diagram p5: board, bottom side, seen from below]

Outline 67.65 x 60.41 mm; copper layers: Top Layer, Bottom Layer. Coordinates in mm from the lower left corner of the outline.
Outline path: 0,58.41 0,2 arc(0.59,0.59) 2,0 65.65,0 arc(67.06,0.59) 67.65,2 67.65,58.41 arc(67.06,59.82) 65.65,60.41 2,60.41 arc(0.59,59.82) 0,58.41
Stack: Top Layer 0.035mm - / Dielectric1 1.51mm FR4 er 4.5 / Bottom Layer 0.035mm -

## Design rules (mm)
template: JLCPCB Capability(Two Layers Board)
spacing copperThickness1oz (default): track to track 0.102, other pairs 0.152 to 0.3
spacing copperThickness2oz: track to track 0.203, other pairs 0.152 to 0.3
track width copperThickness1oz (default): min 0.127, default 0.254, max 2.54
track width copperThickness2oz: min 0.203, default 0.254, max 2.54
differential pair differentialPair (default): width min 0.127, default 0.254, max 2.54; gap min 0.152, default 0.152
via viaSize (default): diameter min 0.5, default 0.61, max 10; hole min 0.3, default 0.305, max 6.3

## Placement (name value [footprint] x y rotation side)
CH1  -  [航模电池线通孔]  55.67 57.06 90 top
CN3  ZX-XH2.54-2PZZ  [CONN-TH_2P-P2.50_HX25003-2A]  63.16 55.92 315 top
CN4  ZX-XH2.54-2PZZ  [CONN-TH_2P-P2.50_HX25003-2A]  62.4 5.5 45 top
CN5  ZX-XH2.54-2PZZ  [CONN-TH_2P-P2.50_HX25003-2A]  5.25 55.16 225 top
CN6  ZX-XH2.54-2PZZ  [CONN-TH_2P-P2.50_HX25003-2A]  5.38 5.38 315 top
JP1  NRF2401  [IDE2X4]  22.14 58.34 0 bottom
OLED1  0.96OLED_4P_MODULE_JX  [0.96OLED_4P]  52.49 48.05 0 top
P1  -  [排针1*8]  4.49 96.05 0 top
SW1  KCD11-2P-R  [SW-TH_2P-L15.0-W10.5-P5.00_KCD11-2P-R]  47.54 55.03 180 top
U1  -  [Module-MPU6050]  48.94 11.47 0 top
U2  STM32F103C8T6-Card  [CONN-TH_L53.3-W22.9_STM32F103C8T6-CARD]  25.7 26.84 270 top
U3  -  [TB6612电机驱动模块]  49.32 16.68 180 bottom
U4  -  [MP1548EN可调电源模块]  0.17 51.86 270 bottom
U5  -  [TB6612电机驱动模块]  16.93 14.52 0 bottom

## Footprints (pads in the part's own frame, mm; a bottom-side part is the same pattern mirrored in y, then rotated)
0.96OLED_4P
  round 1.65 hole 1: 1(-3.81,-0.002) 2(-1.27,0.002) 3(1.27,0.002) 4(3.81,0.002)
CONN-TH_2P-P2.50_HX25003-2A
  rect 1.8x1.8 hole 1.1: 1(-1.25,0)
  round 1.8 hole 1.1: 2(1.25,0)
CONN-TH_L53.3-W22.9_STM32F103C8T6-CARD
  round 1.6 hole 1: 1(-24.13,-7.62) 2(-21.59,-7.62) 3(-19.05,-7.62) 4(-16.51,-7.62) 5(-13.97,-7.62) 6(-11.43,-7.62) 7(-8.89,-7.62) 8(-6.35,-7.62) 9(-3.81,-7.62) 10(-1.27,-7.62) 11(1.27,-7.62) 12(3.81,-7.62) 13(6.35,-7.62) 14(8.89,-7.62) 15(11.43,-7.62) 16(13.97,-7.62) 17(16.51,-7.62) 18(19.05,-7.62) 19(21.59,-7.62) 20(24.13,-7.62) 21(24.13,7.62) 22(21.59,7.62) 23(19.05,7.62) 24(16.51,7.62) 25(13.97,7.62) 26(11.43,7.62) 27(8.89,7.62) 28(6.35,7.62) 29(3.81,7.62) 30(1.27,7.62) 31(-1.27,7.62) 32(-3.81,7.62) 33(-6.35,7.62) 34(-8.89,7.62) 35(-11.43,7.62) 36(-13.97,7.62) 37(-16.51,7.62) 38(-19.05,7.62) 39(-21.59,7.62) 40(-24.13,7.62)
IDE2X4
  rect 1.5x1.5 hole 0.9: 1(0,0)
  round 1.5 hole 0.9: 2(0,2.54) 3(2.54,0) 4(2.54,2.54) 5(5.08,0) 6(5.08,2.54) 7(7.62,0) 8(7.62,2.54)
Module-MPU6050
  rect 1.524x1.524 hole 0.914: 1(-5.08,7.62)
  round 1.524 hole 0.914: 2(-5.08,5.08) 3(-5.08,2.54) 4(-5.08,0) 5(-5.08,-2.54) 6(-5.08,-5.08) 7(-5.08,-7.62) 8(-5.08,-10.16)
MP1548EN可调电源模块
  round 2 hole 1.2: 1(1.5,-3.94) 1(1.5,-1.4) 2(1.5,-15.4) 2(1.5,-12.86)
  round 2 hole 1: 3(20.4,-3.94) 3(20.4,-1.4) 4(20.4,-15.4) 4(20.4,-12.86)
SW-TH_2P-L15.0-W10.5-P5.00_KCD11-2P-R
  oval 1.6x5 hole 0.8x4: 1(-2.5,0) 2(2.5,0)
TB6612电机驱动模块
  round 1.524 hole 0.914: 1(-7.747,8.89) 2(-7.747,6.35) 3(-7.747,3.81) 4(-7.747,1.27) 5(-7.747,-1.27) 6(-7.747,-3.81) 7(-7.747,-6.35) 8(-7.747,-8.89) 9(7.747,-8.89) 10(7.747,-6.35) 11(7.747,-3.81) 12(7.747,-1.27) 13(7.747,1.27) 14(7.747,3.81) 15(7.747,6.35) 16(7.747,8.89)
排针1*8
  rect 1.8x2 hole 1: 1(-2.921,-67.945)
  oval 1.8x2 hole 1: 2(-2.921,-70.485) 3(-2.921,-73.025) 4(-2.921,-75.565) 5(-2.921,-78.105) 6(-2.921,-80.645) 7(-2.921,-83.185) 8(-2.921,-85.725)
航模电池线通孔
  round 3.8 hole 2.54: 1(-4.826,0.254) 2(0.174,0.254)

## Nets
As in the schematic.

Pads without a net: P1 1 7; U1 5 6 7; U2 1 3 4 5 6 7 8 9 10 11 12 21 22 23 24 33 34 37

## Routing (per net, layer and track width the routed paths; a pad name or vN(x,y) marks a point on that pad's centre or on a via; arc(x,y) is an arc through that point)
V1O1: length 41
  Top Layer w0.508: 62.28,56.81 59.48,54.01 59.48,20.36 U3.4
V1O2: length 42.5
  Top Layer w0.508: U3.5 61.13,19.47 61.13,52.12 CN3.2
V2O1: length 8.6
  Top Layer w0.508: CN4.1 61.52,6.13 61.25,6.4 60.53,6.4 60.49,6.36 59.77,6.36 59.41,6.72 59.41,7.6 57.92,9.09 57.92,9.72 57.32,10.33 U3.7
V2O2: length 9.1
  Top Layer w0.508: U3.6 63.28,6.65 CN4.2
V3O1: length 45.7
  Top Layer w0.508: 9.19,13.25 11.22,15.28 11.22,31.16 6.77,35.6 6.77,55.4 CN5.1
V3O2: length 41.5
  Top Layer w0.508: 9.19,15.79 10.46,17.06 10.46,30.65 5.63,35.47 5.63,53.01 4.36,54.28
V4O1: length 16.6
  Top Layer w0.508: 9.19,20.87 4.49,16.18 CN6.1
V4O2: length 15
  Top Layer w0.508: 6.26,4.49 6.26,15.4 9.19,18.33
V7: length 6.5
  Top Layer w1.27: SW1.1 52.62,55.03 CH1.1
VCC: length 215.8
  Top Layer w0.75: P1.8 3.47,12.23 3.47,23.66 P1.2 ; OLED1.2 58.35,40.92 58.35,24.32 U3.2
  Bottom Layer w0.75: JP1.1 13.88,58.34 8.17,52.62 8.17,30.9 2.84,25.57 P1.2 ; U1.1 53.13,19.09 U3.2 ; U1.1 42.97,19.09 U3.14 38.4,23.66 38.4,40.81 U2.38 ; U1.1 42.71,17.95 U3.13 U3.12 37.76,11.6 37.76,4.49 34.46,1.19 31.67,1.19 U5.15 ; P1.8 7.03,10.33 9.19,8.17 12.61,8.17 18.08,2.71 19.22,2.71 U5.15 ; U5.15 26.46,9.95 26.46,10.96 24.68,12.74 U5.13 24.81,13.25 26.71,15.16 26.71,16.3 U5.11
5GD: length 154.8
  Top Layer w1: U4.4 14.65,29.84 14.65,11.22 18.08,7.79 ; U4.4 U4.4 15.57,42.43 10.96,47.03 10.96,52.11 13.12,54.27 37.38,54.27 41.57,58.46 46.52,58.46 47.67,57.32 47.67,52.75 46.4,51.48 46.4,36.24 U3.1 ; U4.4 13.03,9.47 9.19,5.63
CE: length 36.3
  Bottom Layer w0.508: U2.29 27.47,28.87 27.47,48.81 24.68,51.6 JP1.4
IN+: length 34.5
  Top Layer w1.27: U4.2 U4.2 15.57,51.35 16.84,52.62 42.63,52.62 SW1.2
INT: length 68.3
  Top Layer w0.508: U1.8 43.6,1.06 26.58,1.06 21.63,6.01 21.63,44.87 18.08,48.43
IRQ: length 47.7
  Bottom Layer w0.508: 18.08,20.49 20.11,22.52 20.11,50.97 23.41,54.27 23.41,58.72 24.3,59.61 28.49,59.61 JP1.7
MISO: length 26.6
  Bottom Layer w0.508: U2.32 30.39,33.57 30.39,55.16 JP1.8
MOSI: length 32.8
  Bottom Layer w0.508: JP1.5 28.49,57.06 28.49,51.48 29.25,50.72 29.25,32.17 U2.31
MSCL: length 37.8
  Top Layer w0.508: U2.35 35.98,38.27 45.76,28.49 46.14,28.49 46.65,27.98 46.65,27.47 46.14,26.97 45.76,26.97 45.25,26.46 45.25,25.95 45.76,25.44 46.14,25.44 46.65,24.93 46.65,24.43 46.14,23.92 45.76,23.92 45.25,23.41 45.25,22.9 45.76,22.39 46.14,22.39 46.65,21.89 46.65,21.38 46.14,20.87 45.76,20.87 45.25,20.36 45.25,19.85 45.76,19.35 46.14,19.35 46.65,18.84 46.65,18.33 46.14,17.82 45.76,17.82 45.25,17.31 45.25,15.41 U1.3
MSDA: length 38
  Top Layer w0.508: U2.36 35.35,40.81 47.67,28.49 47.67,15.28 U1.4
NSCL: length 17.6
  Bottom Layer w0.508: 18.08,17.95 16.42,19.6 7.92,19.6 7.03,20.49 P1.4
NSDA: length 17.6
  Bottom Layer w0.508: P1.5 7.03,17.95 7.92,17.06 16.42,17.06 18.08,15.41
OSCL: length 80.4
  Bottom Layer w0.508: OLED1.3 51.1,50.72 39.92,50.72 37.51,53.13 32.81,53.13 31.16,51.48 31.16,40.56 32.17,39.54 34.08,39.54 35.09,38.52 35.09,22.9 33.95,21.76 25.57,21.76 25.19,22.14 23.54,22.14 22.9,21.5 22.9,17.7 18.08,12.87
OSDA: length 78.7
  Bottom Layer w0.508: OLED1.4 54.27,46.02 45.25,46.02 44.11,47.16 32.55,47.16 32.05,46.65 32.05,42.46 32.43,42.08 33.95,42.08 35.98,40.05 35.98,20.87 34.33,19.22 32.17,19.22 31.79,19.6 23.89,19.6 23.51,19.22 23.51,17.44 23.41,17.36 23.41,15.66 18.08,10.33
PWM1: length 16.4
  Top Layer w0.508: U3.16 41.06,25.57 39.79,24.3 39.79,19.35 U2.25
PWM2: length 14.2
  Top Layer w0.508: U3.10 40.3,11.6 32.68,11.6 31.79,12.49 31.79,13.89 U2.26
PWM3: length 15.9
  Top Layer w0.508: U5.16 29.25,10.2 29.25,13.38 33.32,17.44 U2.27
PWM4: length 16.9
  Top Layer w0.508: U2.28 31.16,18.33 30.27,18.33 29,19.6 29,20.94 30.39,22.33 30.39,22.79 30.04,23.14 29.05,23.14 26.09,20.18 25.37,20.18 24.68,20.87
SCK: length 32.8
  Bottom Layer w0.508: JP1.6 27.22,51.22 28.36,50.08 28.36,30.52 U2.30

## Copper pours and planes (outline as drawn; the poured copper is in the pictures)
GND on Top Layer: -39.71,62.02 101.39,62.02 101.39,-1.35 -39.71,-1.35
GND on Bottom Layer: -1.74,84.5 70.02,84.5 70.02,-16.59 -1.74,-16.59
